# EAGLE design Sumo_control (EAGLE 6.5.0)
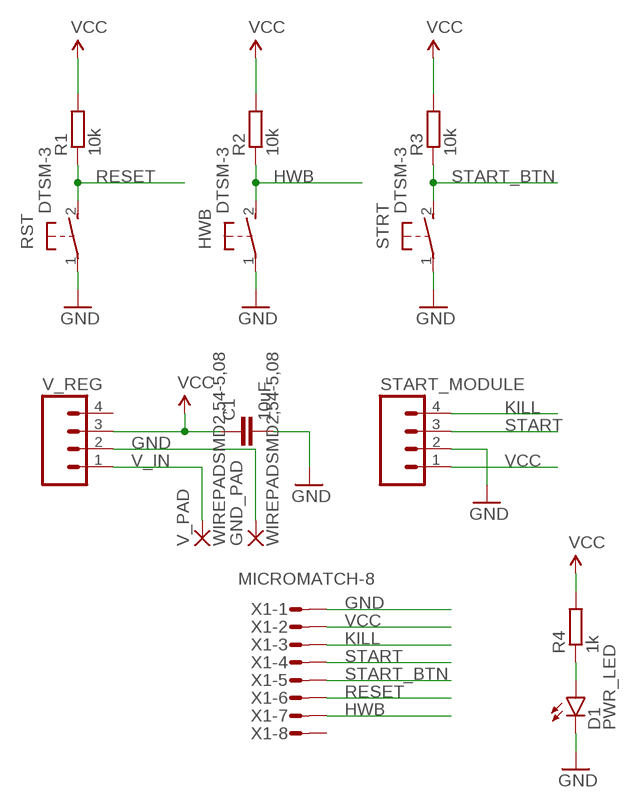
[diagram p0: schematic, sheet 1]

## Parts
C1  10uF  CAP0603-CAP  [0603-CAP]
D1  PWR_LED  LED0603  [LED-0603]
GND_PAD  WIREPADSMD2,54-5,08  [SMD2,54-5,08]
HWB  DTSM-3  [DTSM-3]
R1  10k  R-EU_R0603  [R0603]
R2  10k  R-EU_R0603  [R0603]
R3  10k  R-EU_R0603  [R0603]
R4  1k  R-EU_R0603  [R0603]
RST  DTSM-3  [DTSM-3]
START_MODULE  M04LONGPADS  [1X04_LONGPADS]
STRT  DTSM-3  [DTSM-3]
V_PAD  WIREPADSMD2,54-5,08  [SMD2,54-5,08]
V_REG  M04LONGPADS  [1X04_LONGPADS]
X1  MICROMATCH-8  [MICROMATCH-8]

## Nets
GND: C1.2 D1.C GND_PAD.1(P) HWB.1 RST.1 START_MODULE.2 STRT.1 V_REG.2 X1.1
HWB: HWB.2 R2.1 X1.7
KILL: START_MODULE.4 X1.3
N$1: D1.A R4.1
RESET: R1.1 RST.2 X1.6
START: START_MODULE.3 X1.4
START_BTN: R3.1 STRT.2 X1.5
V_IN: V_PAD.1(P) V_REG.1
VCC: C1.1 R1.2 R2.2 R3.2 R4.2 START_MODULE.1 V_REG.3 X1.2
Unconnected: V_REG.4 X1.8

## Library data of the parts
C1 = SparkFun-Passives:CAP: Capacitor Standard 0603 ceramic capacitor, and 0.1" leaded capacitor.
D1 = SparkFun-LED:LED: LEDs Standard schematic elements and footprints for 5mm, 3mm, 1206, and 0603 sized LEDs. 5mm - Spark Fun Electronics SKU : COM-00529 (and others)
GND_PAD V_PAD = wirepad:WIREPAD: Wire PAD connect wire on PCB
HWB RST STRT = switch-tact:DTSM-3
R1-R4 = resistor:R-EU_: RESISTOR, European symbol
START_MODULE V_REG = SparkFun-Connectors:M04: Header 4 Standard 4-pin 0.1" header. Use with straight break away headers (SKU : PRT-00116), right angle break away headers (PRT-00553), swiss pins (PRT-00743), machine pins (PRT-00117), and female headers (PRT-00115). Molex polarized connector foot print use with SKU : PRT-08231 with associated crimp pins and housings. 1MM SMD Version SKU: PRT-10208; PROD_ID: CONN-09696
X1 = con-amp-micromatch:MICROMATCH-8: MicroMaTch 8 7-215464-8 / 0-215464-8 Drawing Number C-215464 DDEController.pdf; MF: FARNELL; MPN: 7-215464-8; OC_FARNELL: 3784642; OC_NEWARK: 26H0301

## Board
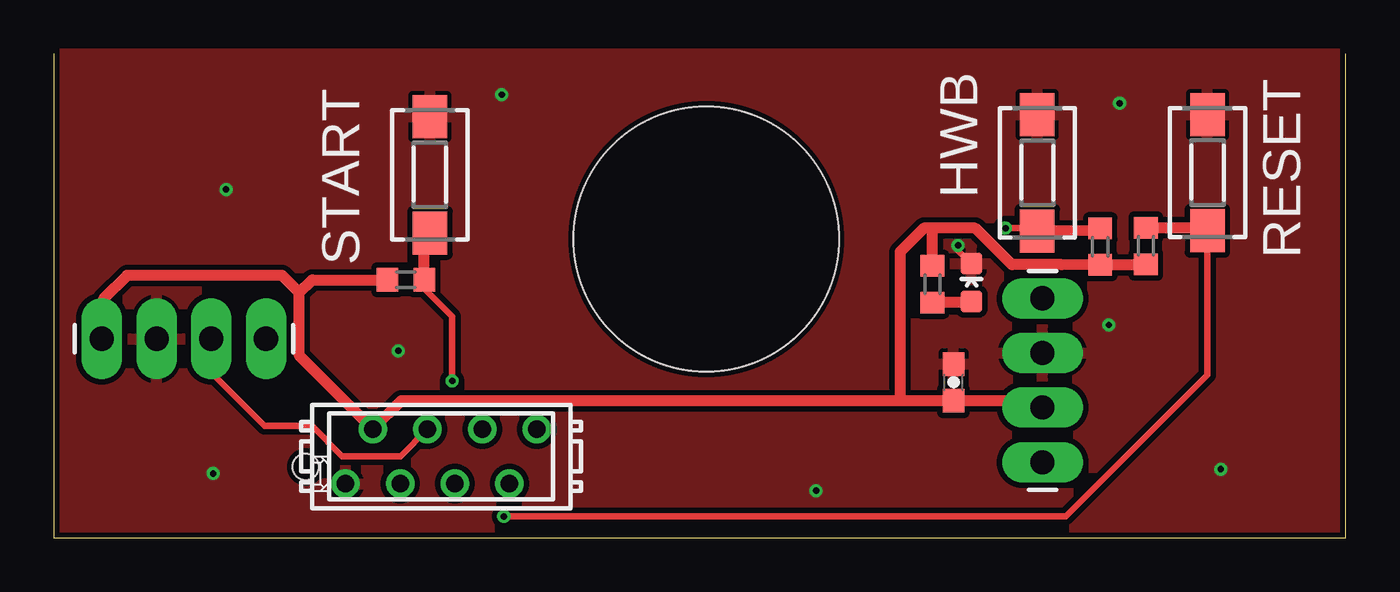
[diagram p1: board, top side]
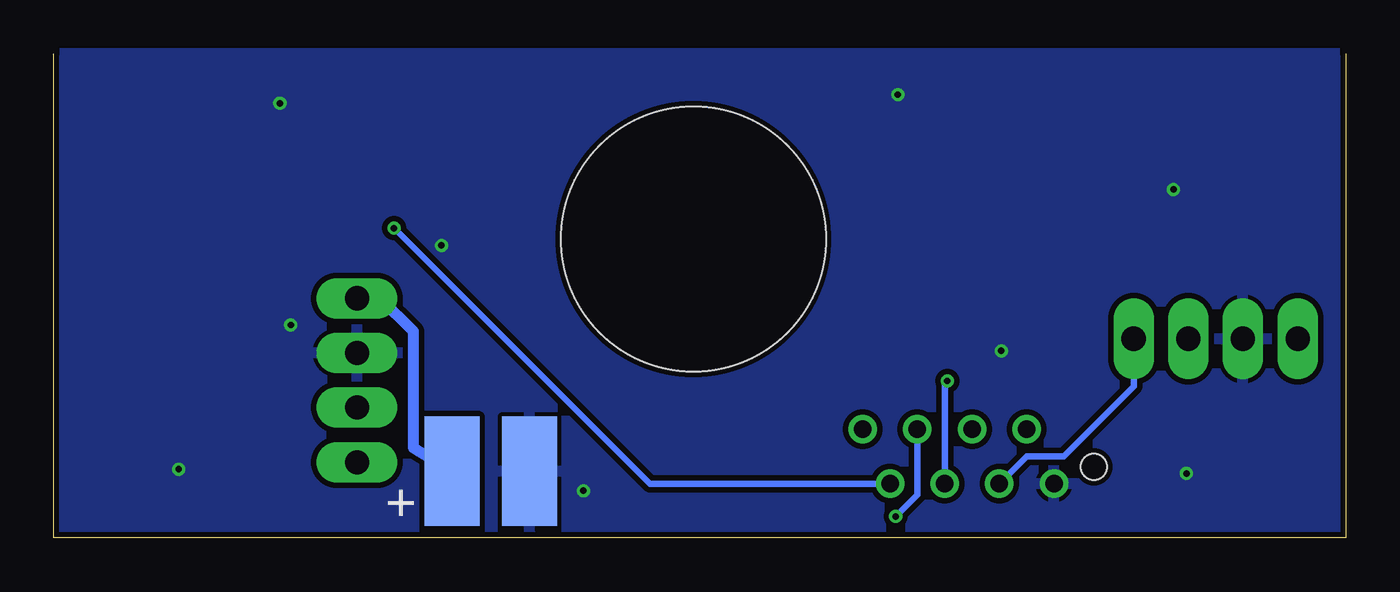
[diagram p2: board, bottom side, seen from below]

Size 60 x 22.5 mm. Coordinates in mm from the lower left corner, seen from the top.
Outline: 60,22.5 60,0 0,0 0,22.5
Copper layers (1*16): Top 0.035mm / dielectric 1.5mm / Bottom 0.035mm
Design rules "SeeedStudio_2layer_DRU_modified": minimum track width 0.2mm, minimum drill 0.3mm, track to track 0.2mm, track to pad 0.2mm, pad to pad 0.2mm, via to via 0.2mm, smd to smd 0mil, copper to edge 10mil, drill to drill 10mil, minimum pad ring 10mil, minimum via ring 6mil, stop-mask expansion 2mil, vias tented up to drill 100mil, thermal gap 0.2mm
Holes 1.2 mm at 11.7,3.3
Holes 12.3 mm at 30.3,13.9

### Footprints (pad centres in the part's own frame; a part is rotated, then mirrored left to right if it is on the bottom)
0603-CAP = smd 1.1 x 1: 1 -0.85,0; 2 0.85,0
LED-0603 = smd 1 x 1: A 0,-0.877; C 0,0.877
SMD2,54-5,08 = smd 2.54 x 5.08: 1 0,0
DTSM-3 = smd 2 x 1.6: 1 -2.7,0; 2 2.7,0
R0603 = smd 1 x 1.1: 1 -0.85,0; 2 0.85,0
1X04_LONGPADS = drill 1.118 pad 1.88 long: 1 0,0; 2 2.54,0; 3 5.08,0; 4 7.62,0
MICROMATCH-8 = drill 0.813: 1 4.445,1.27; 2 3.175,-1.27; 3 1.905,1.27; 4 0.635,-1.27; 5 -0.635,1.27; 6 -1.905,-1.27; 7 -3.175,1.27; 8 -4.445,-1.27

### Placement (x,y rotation side)
C1  41.79,7.23 90 top
D1  42.62,11.87 0 top
GND_PAD  37.9,3.1 0 bottom
HWB  45.68,16.97 270 top
R1  50.72,13.57 270 top
R2  48.6,13.54 270 top
R3  16.35,12 180 top
R4  40.81,11.79 90 top
RST  53.58,16.98 270 top
START_MODULE  2.23,9.26 0 top
STRT  17.47,16.88 270 top
V_PAD  41.5,3.1 0 bottom
V_REG  45.92,11.14 270 top
X1  17.99,3.79 180 top

### Tracks (layer width: path | path; a pad name or v marks a point on that pad's centre or on a via)
GND  (via drill 0.3)
  Top 0.3: v42,13.6 42,13.37 D1.C
  other vias: 8,16.2 7.4,3 16,8.7 49,9.9 54.2,3.2 20.8,20.6 49.5,20.2 35.4,2.2
  pour Bottom (isolate 0.254): 0,22.5 60,22.5 60,0 0,0
  pour Top (isolate 0.254): 0,22.5 60,22.5 60,0 0,0
HWB  (via drill 0.3)
  Top 0.3: v44.2,14.4 45.75,14.4 HWB.2
  Top 0.5: R2.1 48.7,14.29 HWB.2
  Bottom 0.3: v44.2,14.4 32.32,2.52 X1.7
KILL
  Bottom 0.3: X1.3 14.8,3.8 13.1,3.8 9.85,7.05 START_MODULE.4
N$1
  Top 0.5: D1.A 42.71,10.94 R4.1
RESET  (via drill 0.3)
  Top 0.3: v20.9,1 47,1 53.58,7.58 RST.2
  Top 0.5: R1.1 53.44,14.42 RST.2
  Bottom 0.3: X1.6 19.89,2 v20.9,1
START
  Top 0.3: START_MODULE.3 7.31,7.69 9.8,5.2 12,5.2 13.4,3.8 16.09,3.8 X1.4
START_BTN  (via drill 0.3)
  Top 0.3: v18.5,7.3 18.5,10.3 17.2,11.6 R3.1
  Top 0.5: R3.1 17.2,13.91 STRT.2
  Bottom 0.3: X1.5 18.62,7.17 v18.5,7.3
V_IN
  Bottom 0.5: V_PAD.1 43.3,4.2 43.3,9.6 44.84,11.14 V_REG.1
VCC
  Top 0.5: V_REG.3 45.6,6.38 C1.1 39.3,6.38 | 11.4,11.4 10.6,12.2 3.4,12.2 2.3,11.1 2.3,9.33 START_MODULE.1 | R1.2 50.29,12.69 R2.2 46.81,12.7 44.5,12.7 42.8,14.4 40.8,14.4 | 40.8,14.4 40.4,14.4 39.3,13.3 39.3,6.38 | 39.3,6.38 16.14,6.38 X1.2 11.4,8.47 11.4,11.4 | R4.2 40.8,14.4 | 11.4,11.4 12,12 R3.2

### Text on the board
tNames: HWB | START | RESET
bNames: +